# EAGLE design llg_schematic (EAGLE 8.3.1)
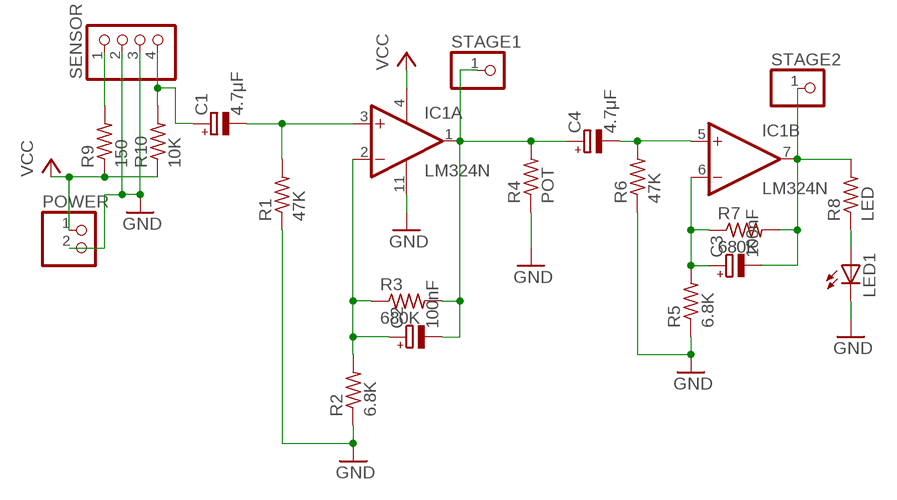
[diagram p0: schematic, sheet 1]

## Parts
C1  4.7μF  CPOL-EUE2.5-6  [E2,5-6]
C2  100nF  CPOL-EUE2.5-6  [E2,5-6]
C3  100nF  CPOL-EUE2.5-6  [E2,5-6]
C4  4.7μF  CPOL-EUE2.5-6  [E2,5-6]
IC1  LM324N  [DIL14]
LED1  LED5MM  [LED5MM]
POWER  PINHD-1X2  [1X02]
R1  47K  R-US_0204/7  [0204/7]
R2  6.8K  R-US_0204/7  [0204/7]
R3  680K  R-US_0204/7  [0204/7]
R4  POT  R-US_0204/7  [0204/7]
R5  6.8K  R-US_0204/7  [0204/7]
R6  47K  R-US_0204/7  [0204/7]
R7  680K  R-US_0204/7  [0204/7]
R8  LED  R-US_0204/7  [0204/7]
R9  150  R-US_0204/7  [0204/7]
R10  10K  R-US_0204/7  [0204/7]
SENSOR  PINHD-1X4  [1X04]
STAGE1  PINHD-1X1  [1X01]
STAGE2  PINHD-1X1  [1X01]

## Nets
GND: IC1.11(P:V-) LED1.K(C) POWER.2 R1.1 R2.1 R4.1 R5.1 R6.1 SENSOR.2 SENSOR.3
N$1: C1.- IC1.3(A:+IN) R1.2
N$2: C2.+ IC1.2(A:-IN) R2.2 R3.1
N$3: C2.- C4.+ IC1.1(A:OUT) R3.2 R4.2 STAGE1.1
N$4: C4.- IC1.5(B:+IN) R6.2
N$5: C3.+ IC1.6(B:-IN) R5.2 R7.1
N$6: C3.- IC1.7(B:OUT) R7.2 R8.2 STAGE2.1
N$7: R9.2 SENSOR.1
N$8: LED1.A R8.1
N$9: C1.+ R10.2 SENSOR.4
VCC: IC1.4(P:V+) POWER.1 R9.1 R10.1
Unconnected: IC1.8(C:OUT) IC1.9(C:-IN) IC1.10(C:+IN) IC1.12(D:+IN) IC1.13(D:-IN) IC1.14(D:OUT)

## Library data of the parts
C1-C4 = rcl:CPOL-EU: POLARIZED CAPACITOR, European symbol
IC1 = linear:LM324: OP AMP
LED1 = led:LED: LED OSRAM: - CHIPLED LG R971, LG N971, LY N971, LG Q971, LY Q971, LO R971, LY R971 LH N974, LH R974 LS Q976, LO Q976, LY Q976 LO Q996 - Hyper CHIPLED LW Q18S LB Q993, LB Q99A, LB R99A - SideLED LS A670, LO A670, LY A670, LG A670, LP A670 LB A673, LV A673, LT A673, LW A673 LH A674 LY A675 LS A676, LA A676, LO A676, LY A676, LW A676 LS A679, LY A679, LG A679 - Hyper Micro SIDELED® LS Y876, LA Y876, LO Y876, LY Y876 LT Y87S - SmartLED LW L88C, LW L88S LB L89C, LB L89S, LG L890 LS L89K, LO L89K, LY L89K LS L896, LA L896, LO L896, LY L896 - TOPLED LS T670, LO T670, LY T670, LG T670, LP T670 LSG T670, LSP T670, LSY T670, LOP T670, LYG T670 LG T671, LOG T671, LSG T671 LB T673, LV T673, LT T673, LW T673 LH T674 LS T676, LA T676, LO T676, LY T676, LB T676, LH T676, LSB T676, LW T676 LB T67C, LV T67C, LT T67C, LS T67K, LO T67K, LY T67K, LW E67C LS E67B, LA E67B, LO E67B, LY E67B, LB E67C, LV E67C, LT E67C LW T67C LS T679, LY T679, LG T679 LS T770, LO T770, LY T770, LG T770, LP T770 LB T773, LV T773, LT T773, LW T773 LH T774 LS E675, LA E675, LY E675, LS T675 LS T776, LA T776, LO T776, LY T776, LB T776 LHGB T686 LT T68C, LB T68C - Hyper Mini TOPLED® LB M676 - Mini TOPLED Santana® LG M470 LS M47K, LO M47K, LY M47K Source: http://www.osram.convergy.de LUXEON: - LUMILED® LXK2-PW12-R00, LXK2-PW12-S00, LXK2-PW14-U00, LXK2-PW14-V00 LXK2-PM12-R00, LXK2-PM12-S00, LXK2-PM14-U00 LXK2-PE12-Q00, LXK2-PE12-R00, LXK2-PE12-S00, LXK2-PE14-T00, LXK2-PE14-U00 LXK2-PB12-K00, LXK2-PB12-L00, LXK2-PB12-M00, LXK2-PB14-N00, LXK2-PB14-P00, LXK2-PB14-Q00 LXK2-PR12-L00, LXK2-PR12-M00, LXK2-PR14-Q00, LXK2-PR14-R00 LXK2-PD12-Q00, LXK2-PD12-R00, LXK2-PD12-S00 LXK2-PH12-R00, LXK2-PH12-S00 LXK2-PL12-P00, LXK2-PL12-Q00, LXK2-PL12-R00 Source: www.luxeon.com KINGBRIGHT: KA-3528ASYC Source: www.kingbright.com
POWER = pinhead:PINHD-1X2: PIN HEADER
R1-R10 = resistor:R-US_: RESISTOR, American symbol
SENSOR = pinhead:PINHD-1X4: PIN HEADER
STAGE1 STAGE2 = pinhead:PINHD-1X1: PIN HEADER

## Board
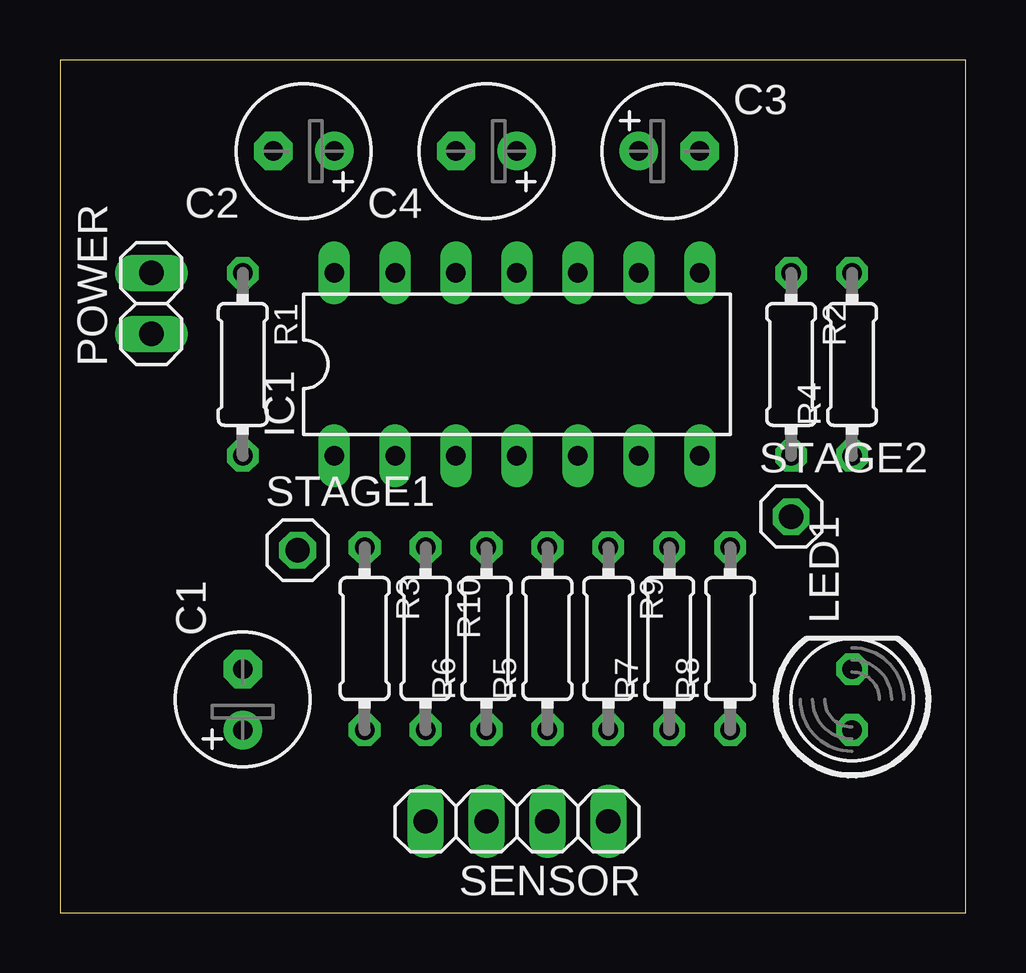
[diagram p1: board, top side]
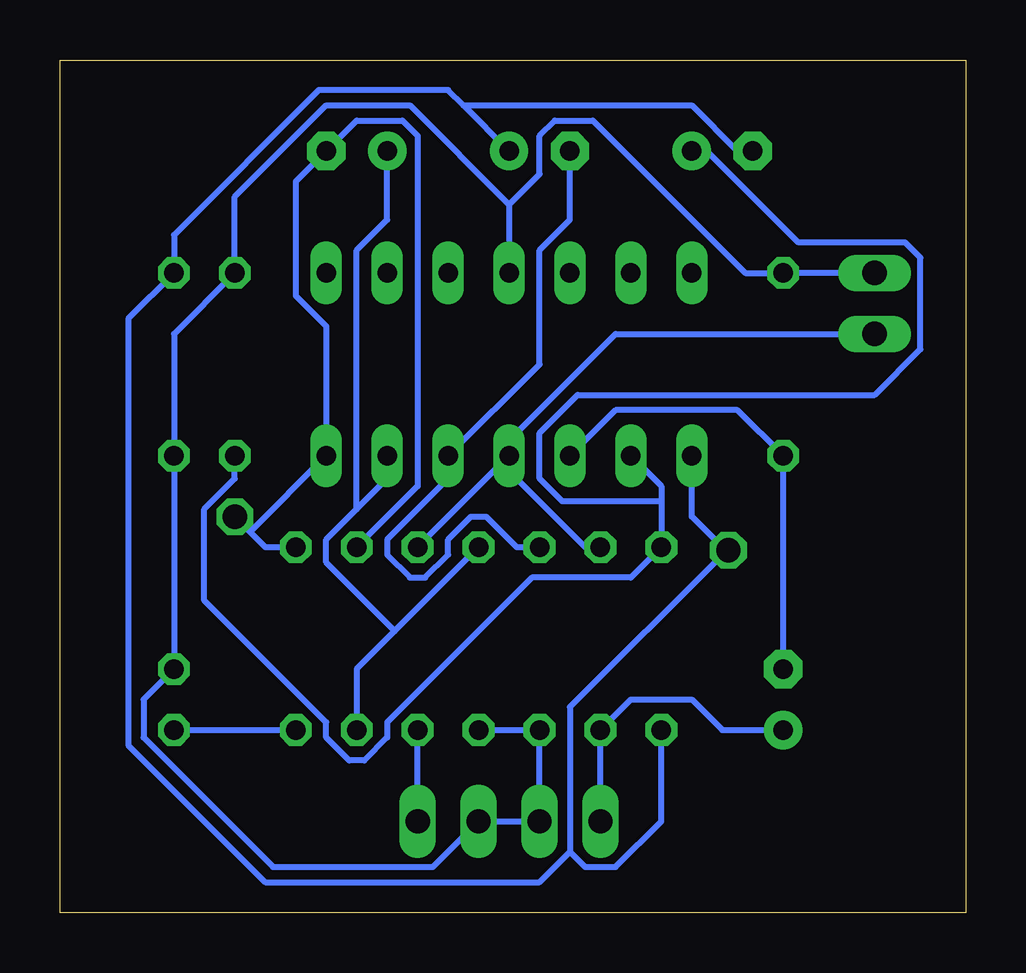
[diagram p2: board, bottom side, seen from below]

Size 37.77 x 35.55 mm. Coordinates in mm from the lower left corner, seen from the top.
Outline: 0,0 37.77,0 37.77,35.55 0,35.55 0,0
Copper layers (1*16): Top 0.035mm / dielectric 1.5mm / Bottom 0.035mm
Design rules "default *": minimum track width 10mil, minimum drill 0.35mm, track to track 8mil, track to pad 8mil, pad to pad 8mil, via to via 8mil, smd to smd 6mil, copper to edge 40mil, drill to drill 6mil, minimum pad ring 10mil, minimum via ring 8mil, stop-mask expansion 4mil, vias tented up to drill 0mil, thermal gap 10mil

### Footprints (pad centres in the part's own frame; a part is rotated, then mirrored left to right if it is on the bottom)
E2,5-6 = drill 0.813 pad 1.6: + -1.27,0 | drill 0.813 pad 1.6 octagon: - 1.27,0
DIL14 = drill 0.813 long: 1 -7.62,-3.81; 2 -5.08,-3.81; 3 -2.54,-3.81; 4 0,-3.81; 5 2.54,-3.81; 6 5.08,-3.81; 7 7.62,-3.81; 8 7.62,3.81; 9 5.08,3.81; 10 2.54,3.81; 11 0,3.81; 12 -2.54,3.81; 13 -5.08,3.81; 14 -7.62,3.81
LED5MM = drill 0.813 octagon: A -1.27,0; K 1.27,0
1X02 = drill 1.016 long: 1 -1.27,0; 2 1.27,0
0204/7 = drill 0.813 octagon: 1 -3.81,0; 2 3.81,0
1X04 = drill 1.016 long: 1 -3.81,0; 2 -1.27,0; 3 1.27,0; 4 3.81,0
1X01 = drill 1.016 octagon: 1 0,0

### Placement (x,y rotation side)
C1  7.62,8.89 90 top
C2  10.16,31.75 180 top
C3  25.4,31.75 0 top
C4  17.78,31.75 180 top
IC1  19.05,22.86 0 top
LED1  33.02,8.89 90 top
POWER  3.81,25.4 90 top
R1  7.62,22.86 270 top
R2  30.48,22.86 270 top
R3  12.7,11.43 270 top
R4  33.02,22.86 90 top
R5  20.32,11.43 90 top
R6  17.78,11.43 90 top
R7  25.4,11.43 90 top
R8  27.94,11.43 90 top
R9  22.86,11.43 270 top
R10  15.24,11.43 270 top
SENSOR  19.05,3.81 180 top
STAGE1  9.91,15.11 0 top
STAGE2  30.48,16.51 0 top

### Tracks (layer width: path | path; a pad name or v marks a point on that pad's centre or on a via)
GND
  Bottom 0.254: R5.1 R6.1 SENSOR.3 SENSOR.2 22.23,1.91 28.89,1.91 34.29,7.3 34.29,8.89 LED1.K R4.1 33.02,24.13 R2.1 30.48,29.84 26.67,33.66 23.18,33.66 19.05,29.53 | POWER.2 R1.1 9.21,26.67 15.56,33.02 17.14,33.02 17.78,32.38 17.78,30.8 19.05,29.53 | 19.05,29.53 IC1.11
N$1
  Bottom 0.254: C1.- R1.2 9.53,20.95 14.61,20.95 IC1.3
N$2
  Bottom 0.254: 12.7,17.14 12.7,17.78 IC1.2 | 12.7,17.14 R3.1 13.97,13.97 18.1,13.97 24.13,7.94 24.13,7.3 25.08,6.35 25.72,6.35 26.67,7.3 26.67,7.94 31.75,13.02 31.75,16.83 30.48,18.1 R2.2 | C2.+ 10.79,31.75 6.99,27.94 2.54,27.94 1.91,27.3 1.91,23.5 3.81,21.59 16.19,21.59 17.78,20 17.78,18.1 16.83,17.14 12.7,17.14
N$3
  Bottom 0.254: IC1.1 11.43,16.51 10.16,15.24 STAGE1.1 10.16,14.92 16.51,8.57 16.51,2.54 | R3.2 12.7,3.81 14.61,1.91 15.88,1.91 16.51,2.54 | C4.+ 20.95,33.66 | 20.95,33.66 21.59,34.29 26.99,34.29 33.02,28.26 R4.2 34.92,24.77 34.92,6.99 29.21,1.27 17.78,1.27 16.51,2.54 | C2.- 9.53,31.75 11.43,33.66 20.95,33.66
N$4
  Bottom 0.254: R6.2 18.73,15.24 20,16.51 20.64,16.51 21.59,15.56 21.59,14.92 22.54,13.97 23.18,13.97 24.13,14.92 24.13,15.56 21.59,18.1 IC1.5 17.78,22.86 17.78,27.62 16.51,28.89 C4.-
N$5
  Bottom 0.254: R7.1 25.4,10.16 23.81,11.75 | R5.2 23.81,11.75 | IC1.6 24.13,18.1 25.4,16.83 | 25.4,16.83 26.67,15.56 26.67,14.61 23.81,11.75 | C3.+ 24.13,28.89 25.4,27.62 25.4,16.83
N$6
  Bottom 0.254: R8.2 29.21,15.24 29.84,15.88 | STAGE2.1 29.84,15.88 | 29.84,15.88 IC1.7 26.67,24.45 27.94,25.72 27.94,30.48 C3.- 25.4,33.02 23.5,33.02 22.86,32.38 22.86,17.78 R7.2
N$7
  Bottom 0.254: SENSOR.1 R9.2
N$8
  Bottom 0.254: LED1.A R8.1
N$9
  Bottom 0.254: SENSOR.4 R10.2 13.97,8.89 11.43,8.89 10.16,7.62 C1.+
VCC
  Bottom 0.254: R10.1 15.88,15.24 19.05,18.41 IC1.4 | IC1.4 R9.1 | POWER.1 14.61,24.13 19.05,19.68 IC1.4